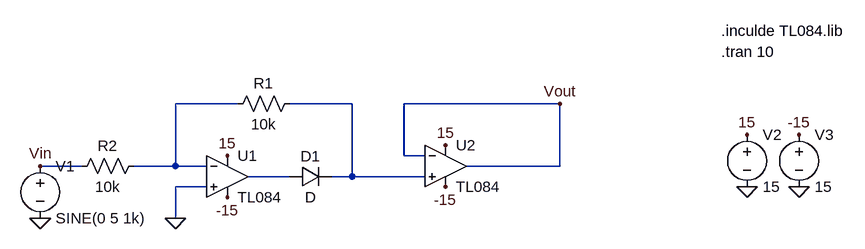
[diagram p0: schematic SuperDiodePontMachinQuiMarchePAs.asc]
SuperDiodePontMachinQuiMarchePAs.asc, the LTspice schematic file:
Version 4
SHEET 1 880 680
WIRE -416 160 -512 160
WIRE -240 160 -336 160
WIRE 80 160 -160 160
WIRE -160 240 -160 160
WIRE -128 240 -160 240
WIRE -656 256 -720 256
WIRE -512 256 -512 160
WIRE -512 256 -576 256
WIRE -464 256 -512 256
WIRE 80 256 80 160
WIRE 80 256 -64 256
WIRE -336 272 -400 272
WIRE -240 272 -240 160
WIRE -240 272 -272 272
WIRE -128 272 -240 272
WIRE -464 288 -512 288
WIRE -512 336 -512 288
FLAG -512 336 0
FLAG -720 336 0
FLAG -432 240 15
FLAG -96 224 15
FLAG 368 208 15
FLAG -432 304 -15
FLAG -96 288 -15
FLAG 448 208 -15
FLAG 368 288 0
FLAG 448 288 0
FLAG -720 256 Vin
FLAG 80 160 Vout
SYMBOL Opamps\\opamp2 -432 208 R0
SYMATTR InstName U1
SYMATTR Value TL084
SYMBOL Opamps\\opamp2 -96 192 R0
SYMATTR InstName U2
SYMATTR Value TL084
SYMBOL diode -336 288 R270
WINDOW 0 32 32 VTop 2
WINDOW 3 0 32 VBottom 2
SYMATTR InstName D1
SYMBOL res -320 144 R90
WINDOW 0 0 56 VBottom 2
WINDOW 3 32 56 VTop 2
SYMATTR InstName R1
SYMATTR Value 10k
SYMBOL res -560 240 R90
WINDOW 0 0 56 VBottom 2
WINDOW 3 32 56 VTop 2
SYMATTR InstName R2
SYMATTR Value 10k
SYMBOL voltage -720 240 R0
WINDOW 123 0 0 Left 0
WINDOW 39 0 0 Left 0
SYMATTR InstName V1
SYMATTR Value SINE(0 5 1k)
SYMBOL voltage 368 192 R0
WINDOW 123 0 0 Left 0
WINDOW 39 0 0 Left 0
SYMATTR InstName V2
SYMATTR Value 15
SYMBOL voltage 448 192 R0
WINDOW 123 0 0 Left 0
WINDOW 39 0 0 Left 0
SYMATTR InstName V3
SYMATTR Value 15
TEXT 328 48 Left 2 !.inculde TL084.lib
TEXT 328 80 Left 2 !.tran 10

The netlist it stands for:
* SuperDiodePontMachinQuiMarchePAs.asc
XU1 0 N001 15 -15 N003 TL084  ; pins In+ In- V+ V- OUT
XU2 N002 Vout 15 -15 Vout TL084  ; pins In+ In- V+ V- OUT
D1 N003 N002 D
R1 N002 N001 10k
R2 N001 Vin 10k
V1 Vin 0 SINE(0 5 1k)
V2 15 0 15
V3 -15 0 15
.model D D
.lib standard.dio
.inculde TL084.lib
.tran 10
.backanno
.end